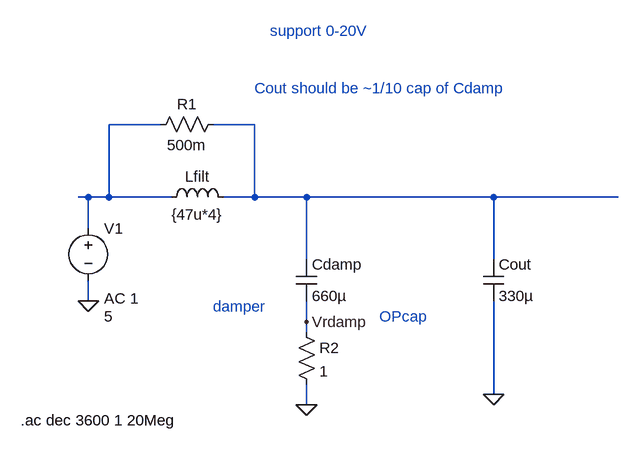
[diagram p0: schematic filtering.asc]
filtering.asc, the LTspice schematic file:
Version 4
SHEET 1 968 680
WIRE -176 160 -256 160
WIRE -32 160 -96 160
WIRE -288 272 -304 272
WIRE -256 272 -256 160
WIRE -256 272 -288 272
WIRE -160 272 -256 272
WIRE -32 272 -32 160
WIRE -32 272 -80 272
WIRE 48 272 -32 272
WIRE 336 272 48 272
WIRE 528 272 336 272
WIRE -288 320 -288 272
WIRE 48 368 48 272
WIRE 336 368 336 272
WIRE -288 432 -288 400
WIRE 48 464 48 432
WIRE 48 480 48 464
WIRE 336 576 336 432
WIRE 48 592 48 560
FLAG 48 592 0
FLAG 336 576 0
FLAG -288 432 0
FLAG 48 464 Vrdamp
SYMBOL ind -176 288 R270
WINDOW 0 32 56 VTop 2
WINDOW 3 5 56 VBottom 2
SYMATTR InstName Lfilt
SYMATTR Value {47u*4}
SYMATTR SpiceLine Rser={33.5m*4}
SYMBOL cap 32 368 R0
SYMATTR InstName Cdamp
SYMATTR Value 660µ
SYMBOL cap 320 368 R0
SYMATTR InstName Cout
SYMATTR Value 330µ
SYMBOL voltage -288 304 R0
WINDOW 3 24 152 Left 2
WINDOW 123 24 124 Left 2
WINDOW 39 0 0 Left 0
SYMATTR Value 5
SYMATTR Value2 AC 1
SYMATTR InstName V1
SYMBOL res -80 144 R90
WINDOW 0 0 56 VBottom 2
WINDOW 3 32 56 VTop 2
SYMATTR InstName R1
SYMATTR Value 500m
SYMBOL res 32 464 R0
SYMATTR InstName R2
SYMATTR Value 1
TEXT -8 16 Left 2 ;support 0-20V
TEXT -96 440 Left 2 ;damper
TEXT 160 456 Left 2 ;OPcap
TEXT -32 104 Left 2 ;Cout should be ~1/10 cap of Cdamp
TEXT -392 616 Left 2 !.ac dec 3600 1 20Meg

The netlist it stands for:
* filtering.asc
Lfilt N001 N002 {47u*4} Rser={33.5m*4}
Cdamp N002 Vrdamp 660µ
Cout N002 0 330µ
V1 N001 0 5 AC 1
R1 N002 N001 500m
R2 Vrdamp 0 1
* support 0-20V
* damper
* OPcap
* Cout should be ~1/10 cap of Cdamp
.ac dec 3600 1 20Meg
.backanno
.end